# EAGLE design Rocket-Control5 (EAGLE 7.6.0)
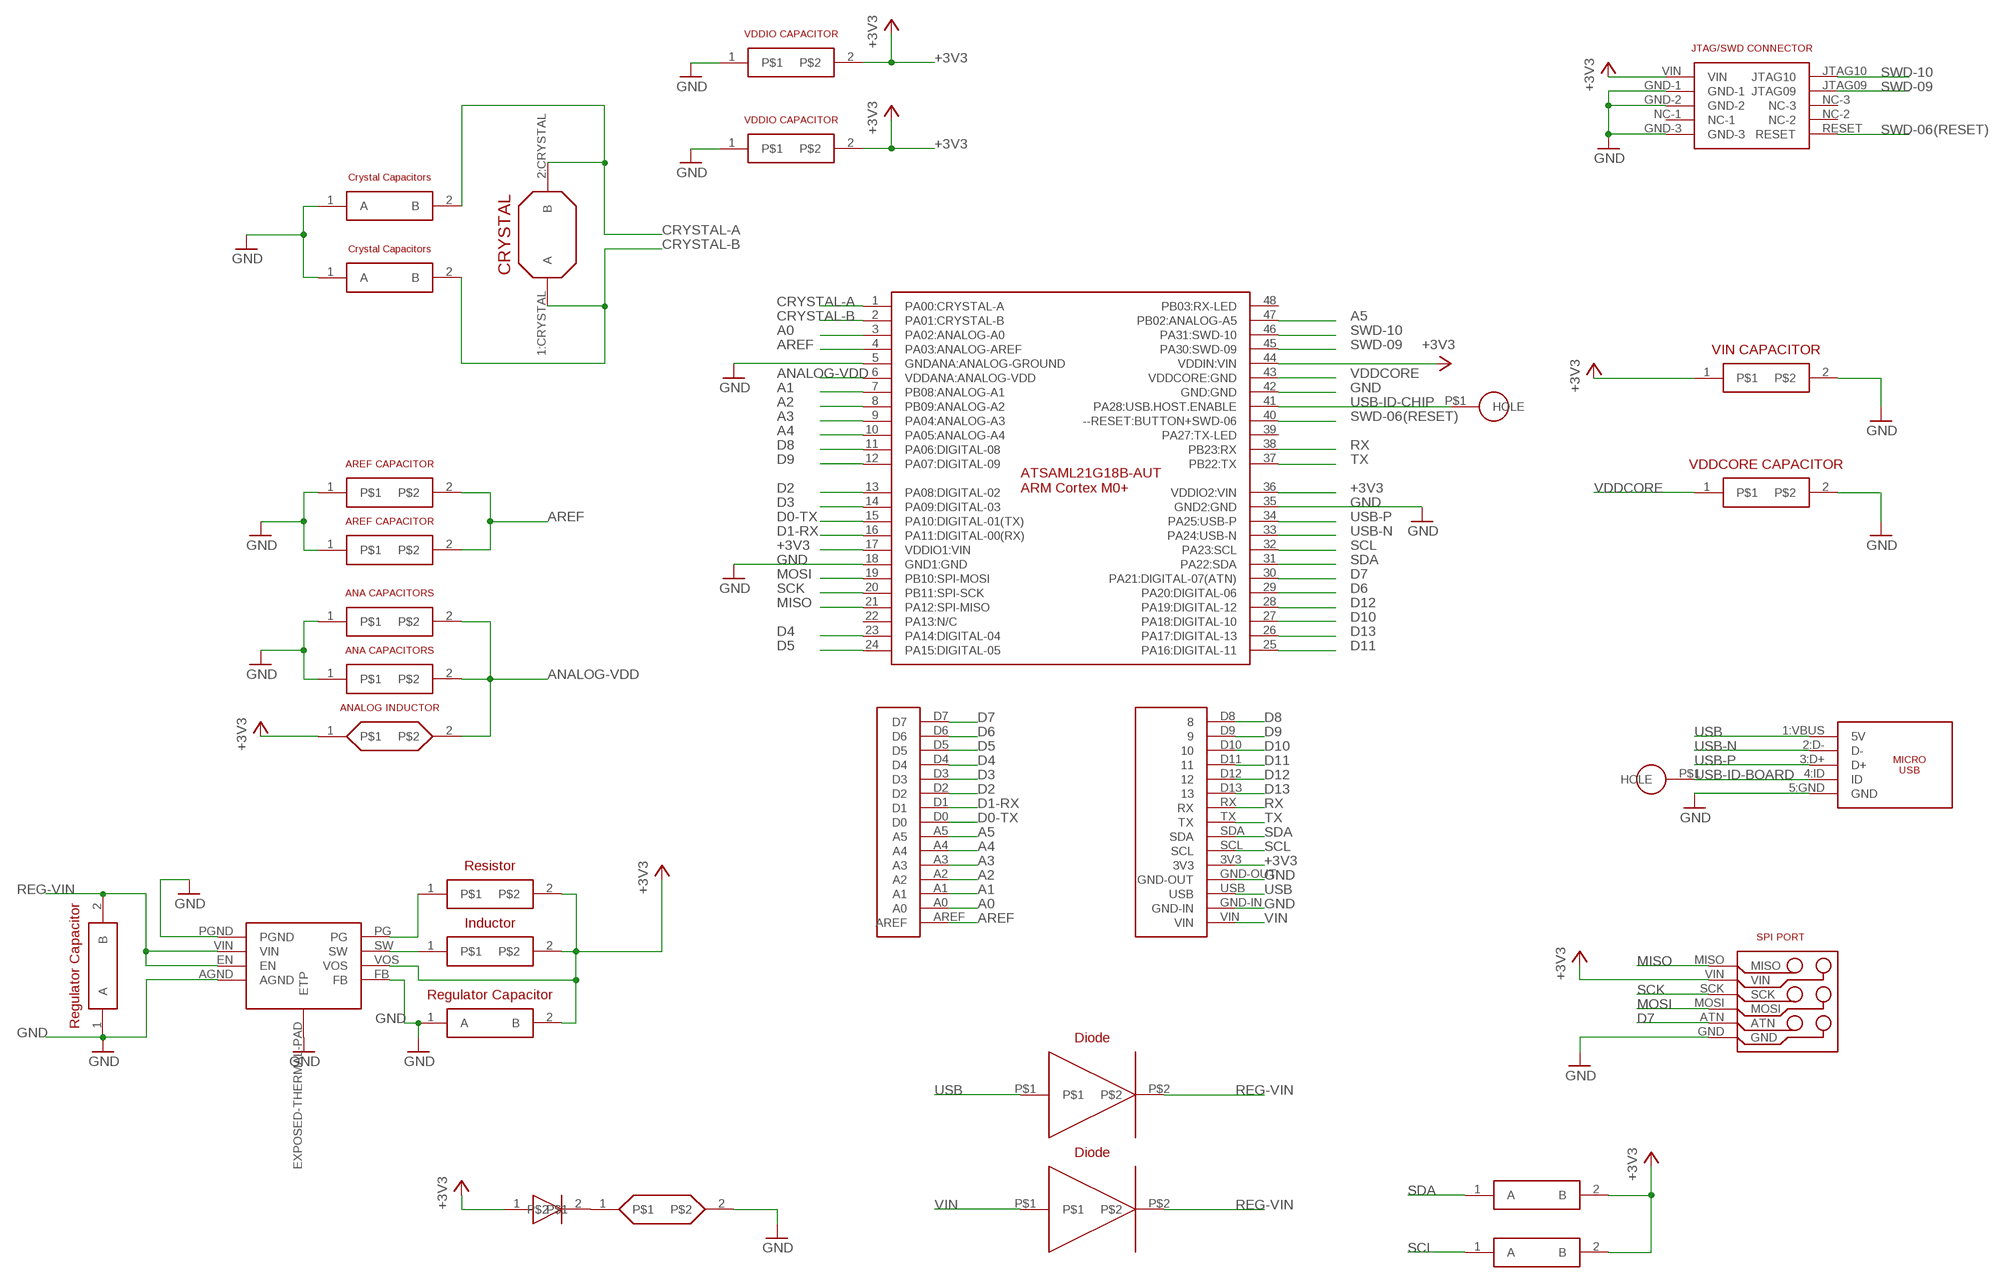
[diagram p0: schematic, sheet 1]

## Parts
U$1  ATSAML21G18B-AUT  [TQFP48]
U$2  CRYSTAL-CAPACITORS  [C0603]
U$3  CRYSTAL-CAPACITORS  [C0603]
U$4  CRYSTAL  [4-SOJ:CRYSTAL]
U$5  REGULATOR  [8-WFDFN-EXPOSED-PAD]
U$6  AREF-CAPACITORS  [C0402]
U$7  AREF-CAPACITORS  [C0402]
U$8  ANALOG-CAPACITORS  [C0402]
U$9  ANALOG-CAPACITORS  [C0402]
U$10  ANALOG-INDUCTOR  [C0603]
U$11  REGULATOR-CAPACITORS  [C0402]
U$12  REGULATOR-CAPACITORS  [C0402]
U$13  REGULATOR-INDUCTOR  [C0603]
U$14  REGULATOR-RESISTOR  [C0603]
U$15  REGULATION-DIODE  [SOD-882]
U$16  REGULATION-DIODE  [SOD-882]
U$17  LED  [C0603]
U$18  LED-RESISTOR  [C0603]
U$19  I2C-PULLUP  [C0402]
U$20  I2C-PULLUP  [C0402]
U$21  HEADER-SIDE-A  [HEADER-SIDE-A]
U$22  HEADER-SIDE-B  [HEADER-SIDE-B]
U$23  HEADER-HOLE  [HEADER-HOLE]
U$24  HEADER-HOLE  [HEADER-HOLE]
U$26  VDDIO-CAPACITOR  [C0402]
U$35  VDDIO-CAPACITOR  [C0402]
U$38  10118194-0001LF:MICRO-USB  [10118194-0001LF:MICRO-USB-B]
U$41  SPI-PORT  [SPI-PORT]
U$56  VDDCORE-CAPACITOR  [C0402]
U$57  VIN-CAPACITOR  [C0402]
U$61  JTAG-MINI  [JTAG-MINI]

## Nets
+3V3: U$1.17(VDDIO1:VIN) U$1.36(VDDIO2:VIN) U$1.44(VDDIN:VIN) U$5.VOS U$10.1 U$12.2(B) U$13.2 U$14.2 U$17.1 U$19.2(B) U$20.2(B) U$22.3V3 U$26.2 U$35.2 U$41.VIN U$57.1 U$61.VIN
A0: U$1.3(PA02:ANALOG-A0) U$21.A0
A1: U$1.7(PB08:ANALOG-A1) U$21.A1
A2: U$1.8(PB09:ANALOG-A2) U$21.A2
A3: U$1.9(PA04:ANALOG-A3) U$21.A3
A4: U$1.10(PA05:ANALOG-A4) U$21.A4
A5: U$1.47(PB02:ANALOG-A5) U$21.A5
ANALOG-VDD: U$1.6(VDDANA:ANALOG-VDD) U$8.2 U$9.2 U$10.2
AREF: U$1.4(PA03:ANALOG-AREF) U$6.2 U$7.2 U$21.AREF
CRYSTAL-A: U$1.1(PA00:CRYSTAL-A) U$2.2(B) U$4.2:CRYSTAL(B)
CRYSTAL-B: U$1.2(PA01:CRYSTAL-B) U$3.2(B) U$4.1:CRYSTAL(A)
D0-TX: U$1.15(PA10:DIGITAL-01(TX)) U$21.D0
D1-RX: U$1.16(PA11:DIGITAL-00(RX)) U$21.D1
D2: U$1.13(PA08:DIGITAL-02) U$21.D2
D3: U$1.14(PA09:DIGITAL-03) U$21.D3
D4: U$1.23(PA14:DIGITAL-04) U$21.D4
D5: U$1.24(PA15:DIGITAL-05) U$21.D5
D6: U$1.29(PA20:DIGITAL-06) U$21.D6
D7: U$1.30(PA21:DIGITAL-07(ATN)) U$21.D7 U$41.ATN
D8: U$1.11(PA06:DIGITAL-08) U$22.D8
D9: U$1.12(PA07:DIGITAL-09) U$22.D9
D10: U$1.27(PA18:DIGITAL-10) U$22.D10
D11: U$1.25(PA16:DIGITAL-11) U$22.D11
D12: U$1.28(PA19:DIGITAL-12) U$22.D12
D13: U$1.26(PA17:DIGITAL-13) U$22.D13
GND: U$1.5(GNDANA:ANALOG-GROUND) U$1.18(GND1:GND) U$1.35(GND2:GND) U$1.42(GND:GND) U$2.1(A) U$3.1(A) U$5.AGND U$5.EXPOSED-THERMAL-PAD(ETP) U$5.FB U$5.PGND U$6.1 U$7.1 U$8.1 U$9.1 U$11.1(A) U$12.1(A) U$18.2 U$22.GND-IN U$22.GND-OUT U$26.1 U$35.1 U$38.5:GND(GND) U$41.GND U$56.2 U$57.2 U$61.GND-1 U$61.GND-2 U$61.GND-3
MISO: U$1.21(PA12:SPI-MISO) U$41.MISO
MOSI: U$1.19(PB10:SPI-MOSI) U$41.MOSI
N$1: U$5.SW U$13.1
N$2: U$17.2 U$18.1
N$3: U$5.PG U$14.1
REG-VIN: U$5.EN U$5.VIN U$11.2(B) U$15.P$2 U$16.P$2
RX: U$1.38(PB23:RX) U$22.RX
SCK: U$1.20(PB11:SPI-SCK) U$41.SCK
SCL: U$1.32(PA23:SCL) U$20.1(A) U$22.SCL
SDA: U$1.31(PA22:SDA) U$19.1(A) U$22.SDA
SWD-06(RESET): U$1.40(--RESET:BUTTON+SWD-06) U$61.RESET
SWD-09: U$1.45(PA30:SWD-09) U$61.JTAG09
SWD-10: U$1.46(PA31:SWD-10) U$61.JTAG10
TX: U$1.37(PB22:TX) U$22.TX
USB: U$15.P$1 U$22.USB U$38.1:VBUS(5V)
USB-ID-BOARD: U$23.P$1(HOLE) U$38.4:ID(ID)
USB-ID-CHIP: U$1.41(PA28:USB.HOST.ENABLE) U$24.P$1(HOLE)
USB-N: U$1.33(PA24:USB-N) U$38.2:D-(D-)
USB-P: U$1.34(PA25:USB-P) U$38.3:D+(D+)
VDDCORE: U$1.43(VDDCORE:GND) U$56.1
VIN: U$16.P$1 U$22.VIN
Unconnected: U$1.22(PA13:N/C) U$1.39(PA27:TX-LED) U$1.48(PB03:RX-LED) U$61.NC-1 U$61.NC-2 U$61.NC-3

## Library data of the parts
U$1 = RocketControlBoard:ATSAML21G18B-AUT
U$2 U$3 = RocketControlBoard:CRYSTAL-CAPACITORS
U$4 = RocketControlBoard:CRYSTAL
U$5 = RocketControlBoard:REGULATOR
U$6 U$7 = RocketControlBoard:AREF-CAPACITORS
U$8 U$9 = RocketControlBoard:ANALOG-CAPACITORS
U$10 = RocketControlBoard:ANALOG-INDUCTOR
U$11 U$12 = RocketControlBoard:REGULATOR-CAPACITORS
U$13 = RocketControlBoard:REGULATOR-INDUCTOR
U$14 = RocketControlBoard:REGULATOR-RESISTOR
U$15 U$16 = RocketControlBoard:REGULATION-DIODE
U$17 = RocketControlBoard:LED
U$18 = RocketControlBoard:LED-RESISTOR
U$19 U$20 = RocketControlBoard:I2C-PULLUP
U$21 = RocketControlBoard:HEADER-SIDE-A
U$22 = RocketControlBoard:HEADER-SIDE-B
U$23 U$24 = RocketControlBoard:HEADER-HOLE
U$26 U$35 = RocketControlBoard:VDDIO-CAPACITOR
U$38 = RocketControlBoard:10118194-0001LF:MICRO-USB
U$41 = RocketControlBoard:SPI-PORT
U$56 = RocketControlBoard:VDDCORE-CAPACITOR
U$57 = RocketControlBoard:VIN-CAPACITOR
U$61 = RocketControlBoard:JTAG-MINI

## Board
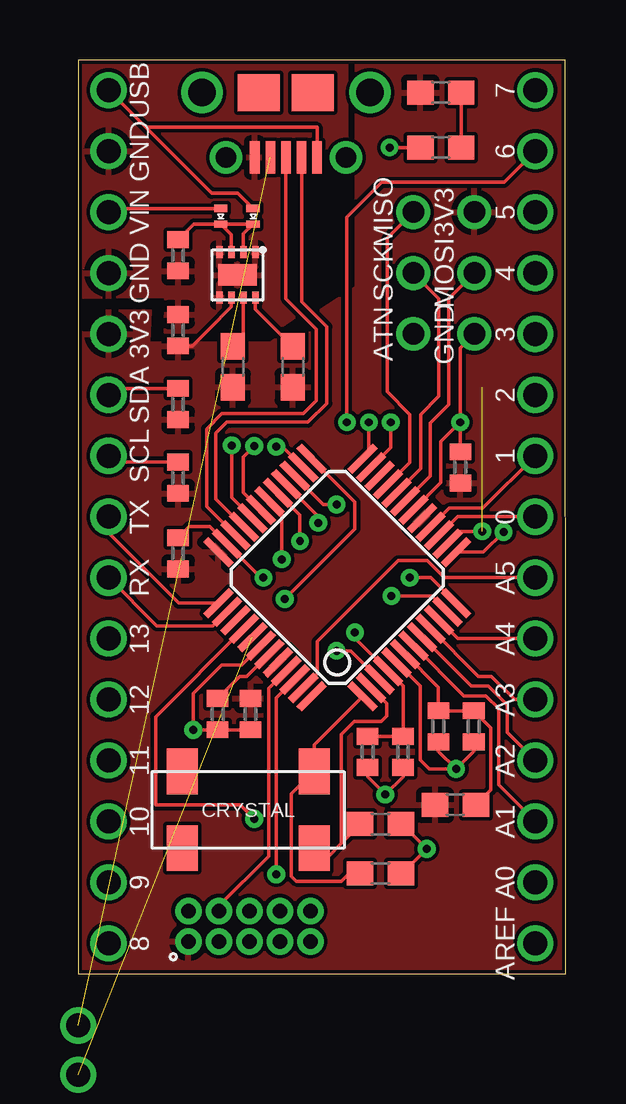
[diagram p1: board, top side]
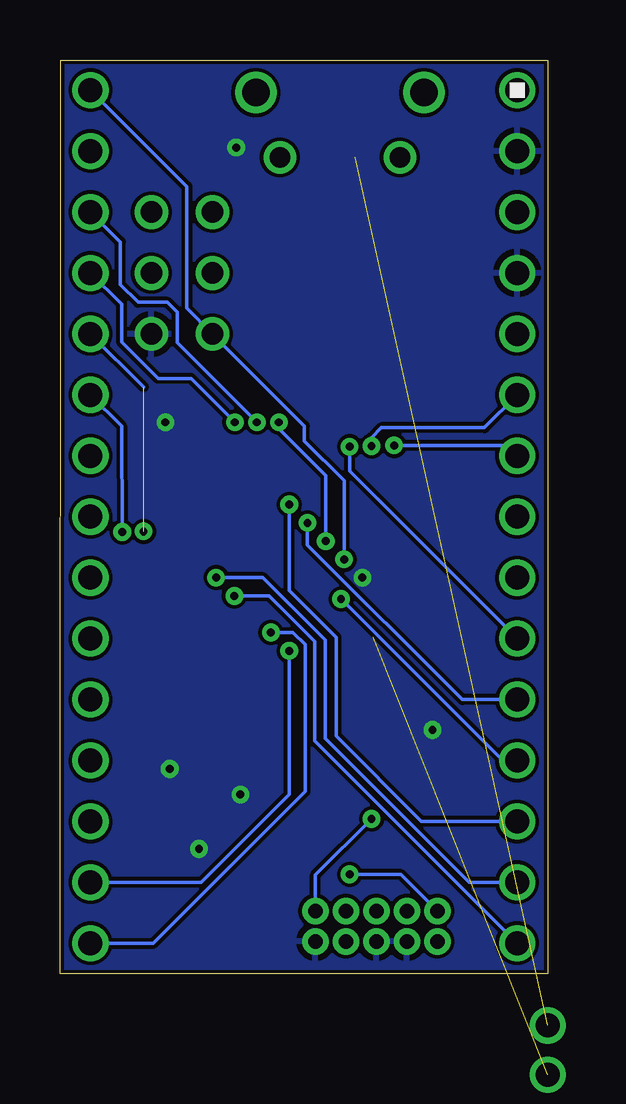
[diagram p2: board, bottom side, seen from below]

Size 20.32 x 38.09 mm. Coordinates in mm from the lower left corner, seen from the top.
Outline: 0,0 20.32,0 20.3,38.09 0,38.09 0,0
Copper layers (1*16): Top 0.035mm / dielectric 1.5mm / Bottom 0.035mm
Design rules "pcbway *": minimum track width 6mil, minimum drill 12mil, track to track 6mil, track to pad 6mil, pad to pad 6mil, via to via 6mil, smd to smd 6mil, copper to edge 6mil, drill to drill 6mil, minimum pad ring 10mil, minimum via ring 8mil, stop-mask expansion 4mil, vias tented up to drill 150mil, thermal gap 10mil

### Footprints (pad centres in the part's own frame; a part is rotated, then mirrored left to right if it is on the bottom)
TQFP48 = smd 0.3 x 1.5: 1 -2.75,-4.25; 2 -2.25,-4.25; 3 -1.75,-4.25; 4 -1.25,-4.25; 5 -0.75,-4.25; 6 -0.25,-4.25; 7 0.25,-4.25; 8 0.75,-4.25; 9 1.25,-4.25; 10 1.75,-4.25; 11 2.25,-4.25; 12 2.75,-4.25; 25 2.75,4.25; 26 2.25,4.25; 27 1.75,4.25; 28 1.25,4.25; 29 0.75,4.25; 30 0.25,4.25; 31 -0.25,4.25; 32 -0.75,4.25; 33 -1.25,4.25; 34 -1.75,4.25; 35 -2.25,4.25; 36 -2.75,4.25 | smd 1.5 x 0.3: 13 4.25,-2.75; 14 4.25,-2.25; 15 4.25,-1.75; 16 4.25,-1.25; 17 4.25,-0.75; 18 4.25,-0.25; 19 4.25,0.25; 20 4.25,0.75; 21 4.25,1.25; 22 4.25,1.75; 23 4.25,2.25; 24 4.25,2.75; 37 -4.25,2.75; 38 -4.25,2.25; 39 -4.25,1.75; 40 -4.25,1.25; 41 -4.25,0.75; 42 -4.25,0.25; 43 -4.25,-0.25; 44 -4.25,-0.75; 45 -4.25,-1.25; 46 -4.25,-1.75; 47 -4.25,-2.25; 48 -4.25,-2.75
C0603 = smd 1.1 x 1: 1 -0.85,0; 2 0.85,0
4-SOJ:CRYSTAL = smd 1.3 x 1.9: 1:CRYSTAL -2.75,1.6; 2:CRYSTAL -2.75,-1.6; 3:N/C 2.75,1.6; 4:N/C 2.75,-1.6
8-WFDFN-EXPOSED-PAD = smd 0.28 x 0.5: AGND 1.5,0; EN 1,0; FB 1.5,1.9; PG 0,1.9; PGND 0,0; SW 0.5,1.9; VIN 0.5,0; VOS 1,1.9 | smd 1.6 x 0.9: EXPOSED-THERMAL-PAD 0.75,0.95
C0402 = smd 0.7 x 0.9: 1 -0.65,0; 2 0.65,0
SOD-882 = smd 0.3 x 0.55: P$1 0,0; P$2 0.65,0
HEADER-SIDE-A = drill 1: A0 0,-12.7; A1 0,-10.16; A2 0,-7.62; A3 0,-5.08; A4 0,-2.54; A5 0,0; AREF 0,-15.24; D0 0,2.54; D1 0,5.08; D2 0,7.62; D3 0,10.16; D4 0,12.7; D5 0,15.24; D6 0,17.78; D7 0,20.32
HEADER-SIDE-B = drill 1: 3V3 -12.7,0; D8 -38.1,0; D9 -35.56,0; D10 -33.02,0; D11 -30.48,0; D12 -27.94,0; D13 -25.4,0; GND-IN -5.08,0; GND-OUT -10.16,0; RX -22.86,0; SCL -17.78,0; SDA -15.24,0; TX -20.32,0; USB -2.54,0; VIN -7.62,0
HEADER-HOLE = drill 1: P$1 0,0
10118194-0001LF:MICRO-USB-B = smd 1.35 x 0.4: 1:VBUS 2.7,1.3; 2:D- 2.7,0.65; 3:D+ 2.7,0; 4:ID 2.7,-0.65; 5:GND 2.7,-1.3 | drill 0.85: NC1 2.7,2.5; NC6 2.7,-2.5 | drill 1.15: NC2 0,3.5; NC5 0,-3.5 | smd 1.55 x 1.75: NC3 0,1.125; NC4 0,-1.125
SPI-PORT = drill 0.9: ATN 0,0; GND 2.54,0; MISO 0,5.08; MOSI 2.54,2.54; SCK 0,2.54; VIN 2.54,5.08
JTAG-MINI = drill 0.6: GND-1 0.635,4.445; GND-2 0.635,3.175; GND-3 0.635,0.635; JTAG09 1.905,4.445; JTAG10 1.905,5.715; NC-1 0.635,1.905; NC-2 1.905,1.905; NC-3 1.905,3.175; RESET 1.905,0.635; VIN 0.635,5.715

### Placement (x,y rotation side)
U$1  10.79,16.51 45 top
U$2  12.6,4.19 180 top
U$3  12.6,6.25 180 top
U$4  7.09,6.83 180 top
U$5  7.39,30.07 180 top
U$6  13.54,9.25 90 top
U$7  12.06,9.25 90 top
U$8  16.48,10.31 90 top
U$9  15.01,10.31 90 top
U$10  15.72,7.04 0 top
U$11  4.17,29.95 90 top
U$12  4.17,26.82 270 top
U$13  6.45,25.3 270 top
U$14  8.94,25.3 270 top
U$15  7.29,31.9 270 top
U$16  5.94,31.9 270 top
U$17  15.11,36.73 0 top
U$18  15.11,34.44 180 top
U$19  4.17,23.75 270 top
U$20  4.17,20.68 270 top
U$21  19.05,16.51 0 top
U$22  1.27,39.37 90 top
U$23  0,-2.16 0 top
U$24  0,-4.22 0 top  (outside the outline)
U$26  15.93,21.11 270 top
U$35  4.17,17.53 270 top
U$38  8.66,36.73 270 top
U$41  13.97,26.67 0 top
U$56  5.82,10.82 270 top
U$57  7.19,10.82 270 top
U$61  10.31,0.71 90 top

### Tracks (layer width: path | path; a pad name or v marks a point on that pad's centre or on a via)
+3V3
  Top 0.152: U$5.VOS 6.39,27.8 5.49,26.9 4.75,26.17 U$12.2
  pour Top: -0.89,-1.04 21.39,-1.04 21.39,39.12 11.58,39.12 11.58,28.6 8.03,26.29 2.95,26.31 3,27.64 -0.89,27.61
A0  (via drill 0.33)
  Top 0.152: U$1.3 11.37,13.46 v10.77,13.46
  Bottom 0.152: U$21.A0 14.43,3.81 10.77,7.47 v10.77,13.46
A1
  Top 0.152: U$21.A1 17.53,7.87 17.53,11.05 16.99,11.58 16.08,11.58 U$1.7
A2
  Top 0.152: U$21.A2 17.88,10.06 17.88,11.2 17.09,11.99 16.38,11.99 U$1.8
A3
  Top 0.152: U$21.A3 18.19,11.43 17.22,12.39 16.68,12.39 U$1.9
A4
  Top 0.152: U$21.A4 15.81,13.97 U$1.10
A5
  Top 0.152: U$1.47 9.96,12.49 9.96,13.84 13.34,17.22 14.55,17.22 15.27,16.51 U$21.A5
ANALOG-VDD
  Top 0.152: U$1.6 15.01,11.94 U$9.2 U$8.2 17.2,10.25 17.2,7.66 U$10.2
AREF  (via drill 0.33)
  Top 0.152: U$7.2 U$6.2 13.54,12 U$1.4 11.53,14.01 v11.53,14.22
  Bottom 0.152: U$21.AREF 16.43,1.27 10.11,7.59 10.11,13.72 10.62,14.22 v11.53,14.22
CRYSTAL-A
  Top 0.152: U$1.1 9.84,9.54 U$4.2:CRYSTAL 8.89,7.49 8.89,4.06 9.09,3.86 10.97,3.86 11.3,4.19 U$2.2
CRYSTAL-B
  Top 0.152: U$3.2 10.97,5.44 | 10.97,5.44 10.38,4.83 U$4.1:CRYSTAL | U$1.2 12.85,11.27 12.85,10.74 12.62,10.52 11.51,10.52 10.97,9.98 10.97,5.44
D0-TX
  Top 0.152: U$1.15 15.81,19.05 U$21.D0
D1-RX
  Top 0.152: U$1.16 15.46,19.41 16.87,19.41 U$21.D1
D2  (via drill 0.33)
  Top 0.152: U$1.13 16.89,17.57 v17.73,18.41
  Bottom 0.152: U$21.D2 17.75,22.84 v17.73,18.41
D3  (via drill 0.33)  (1 unrouted)
  Top 0.152: U$1.14 15.91,18.44 v16.84,18.44
  Bottom 0.152: 16.84,24.46 U$21.D3
D4  (via drill 0.33)
  Top 0.152: U$1.23 13.03,21.93 v13.03,22.99
  Bottom 0.152: U$21.D4 17.75,27.91 17.75,26.34 16.23,24.82 14.86,24.82 v13.03,22.99
D5  (via drill 0.33)
  Top 0.152: U$1.24 12.12,21.72 v12.12,22.99
  Bottom 0.152: U$21.D5 17.8,30.5 17.8,28.73 17.07,27.99 15.85,27.99 15.44,27.58 15.44,26.31 v12.12,22.99
D6  (via drill 0.33)
  Top 0.152: U$1.29 9.25,19.12 v9.25,18.03 | v11.2,22.99 11.2,31.55 12.65,32.99 17.75,32.99 U$21.D6
  Bottom 0.152: v11.2,22.99 11.2,22.73 9.25,20.78 v9.25,18.03
D7  (via drill 0.33)
  Top 0.152: U$1.30 8.48,19.18 v8.48,17.27
  Bottom 0.152: v8.48,17.27 8.48,20.55 10.13,22.2 10.13,22.84 U$41.ATN 15.04,27.74 15.04,32.82 U$21.D7
D8  (via drill 0.33)
  Top 0.152: U$1.11 14.74,15.75 v13.06,15.75
  Bottom 0.152: U$22.D8 9.7,9.7 9.7,13.84 11.61,15.75 v13.06,15.75
D9  (via drill 0.33)
  Top 0.152: U$1.12 14.68,16.51 v13.82,16.51
  Bottom 0.152: U$22.D9 3.28,3.81 9.27,9.8 9.27,13.92 11.86,16.51 v13.82,16.51
D10  (via drill 0.33)
  Top 0.152: U$1.27 10.22,19.56 v10.77,19.56
  Bottom 0.152: v10.77,19.56 10.77,15.98 8.81,14.02 8.81,9.91 5.26,6.35 U$22.D10
D11  (via drill 0.33)
  Top 0.152: U$1.25 11.53,19.66 11.53,18.54 v8.61,15.62
  Bottom 0.152: U$22.D11 1.88,8.89 v8.61,15.62
D12  (via drill 0.33)
  Top 0.152: U$1.28 10.01,19.07 v10.01,18.8
  Bottom 0.152: U$22.D12 3.56,11.43 10.01,17.88 v10.01,18.8
D13  (via drill 0.33)
  Top 0.152: v8.26,21.97 8.52,21.97 U$1.26
  Bottom 0.152: U$22.D13 8.26,20.95 v8.26,21.97
GND  (via drill 0.33)
  Top 0.152: U$1.18 15.11,20.47 15.11,22.17 v15.93,22.99 | U$41.GND 15.93,26.09 v15.93,22.99 | U$7.1 12.06,8.2 v12.8,7.47 13.54,8.2 U$6.1 | U$1.5 14.25,11.99 14.25,8.91 14.63,8.53 v15.75,8.53 | U$1.42 6.81,12.88 5.99,12.88 4.8,11.68 v4.8,10.16 5.81,10.16 U$56.2 U$57.2 | U$9.1 15.01,9.27 v15.75,8.53 | U$8.1 16.48,9.27 v15.75,8.53 | U$26.1 v15.93,22.99 | v7.72,16.51 7.61,16.51 U$1.35 5.48,18.64 4.63,18.64 U$35.1 | U$2.1 13.51,4.19 v14.53,5.21 13.49,6.25 U$3.1 | U$18.2 v12.98,34.44
  pour Bottom: -0.46,-0.58 20.95,-0.58 20.95,38.43 -0.46,38.43
  pour Top: -0.91,28.19 3.66,28.22 3.63,26.72 8.13,26.75 11.2,28.88 11.2,39.19 -0.97,39.19
MISO
  Top 0.152: U$1.21 13.82,21.3 13.82,23.32 12.88,24.26 12.88,30.66 U$41.MISO
MOSI
  Top 0.152: U$1.19 14.68,20.75 14.68,22.96 15.44,23.72 15.44,28.14 U$41.MOSI
N$1
  Top 0.152: U$5.SW 6.89,26.59 U$13.1
N$2
  Top 0.152: U$17.2 U$18.1
N$3
  Top 0.152: U$5.PG 7.39,27.7 U$14.1
REG-VIN
  Top 0.152: U$16.P$2 U$15.P$2 | U$15.P$2 7.39,31.15 | U$16.P$2 4.82,31.25 U$11.2 | U$5.VIN 6.89,30.85 U$15.P$2 | U$5.EN 6.39,30.8 U$16.P$2
RX
  Top 0.152: U$1.38 5.61,14.5 3.28,14.5 U$22.RX
SCK
  Top 0.152: U$1.20 14.28,21.05 14.28,23.32 15.04,24.08 15.04,28.14 U$41.SCK
SCL  (via drill 0.33)
  Top 0.152: U$1.32 6.4,19.84 v6.4,22.02 | U$20.1 1.53,21.33 U$22.SCL
  Bottom 0.152: U$22.SCL 1.7,22.02 v6.4,22.02
SDA  (via drill 0.33)
  Top 0.152: U$1.31 6.88,20.07 6.88,21.54 v7.34,22 | U$19.1 1.54,24.4 U$22.SDA
  Bottom 0.152: U$22.SDA 2.64,22.76 6.93,22.76 7.34,22.35 v7.34,22
SWD-06(RESET)  (via drill 0.33)
  Top 0.152: U$1.40 3.23,10.71 3.23,7.04 6.76,7.04 v7.34,6.45
  Bottom 0.152: U$61.RESET 9.68,4.12 v7.34,6.45
SWD-09
  Top 0.152: U$1.45 7.95,11.9 7.95,4.9 5.87,2.82 U$61.JTAG09
SWD-10  (via drill 0.33)
  Top 0.152: U$1.46 8.26,11.49 v8.26,4.14
  Bottom 0.152: U$61.JTAG10 6.12,4.14 v8.26,4.14
TX
  Top 0.152: U$22.TX 1.27,18.36 4.18,15.45 U$1.37
USB
  Top 0.152: U$38.1:VBUS 9.96,35.28 2.82,35.28 | 2.82,35.28 U$22.USB | U$15.P$1 6.66,32.54 5.56,32.54 2.82,35.28
USB-ID-BOARD  (1 unrouted)
USB-ID-CHIP  (1 unrouted)
USB-N
  Top 0.152: U$38.2:D- 9.31,28.03 10.36,26.98 10.36,23.77 9.58,22.99 6.2,22.99 5.74,22.53 5.74,19.8 U$1.33
USB-P
  Top 0.152: U$38.3:D+ 8.66,28.14 9.93,26.87 9.93,23.9 9.37,23.34 5.99,23.34 5.36,22.71 5.36,19.47 U$1.34
VDDCORE
  Top 0.152: U$56.1 6.74,12.39 7.03,12.39 U$1.43
VIN
  Top 0.152: U$22.VIN 1.42,31.9 U$16.P$1